# EAGLE design PiZero_breakout (EAGLE 8.6.0)
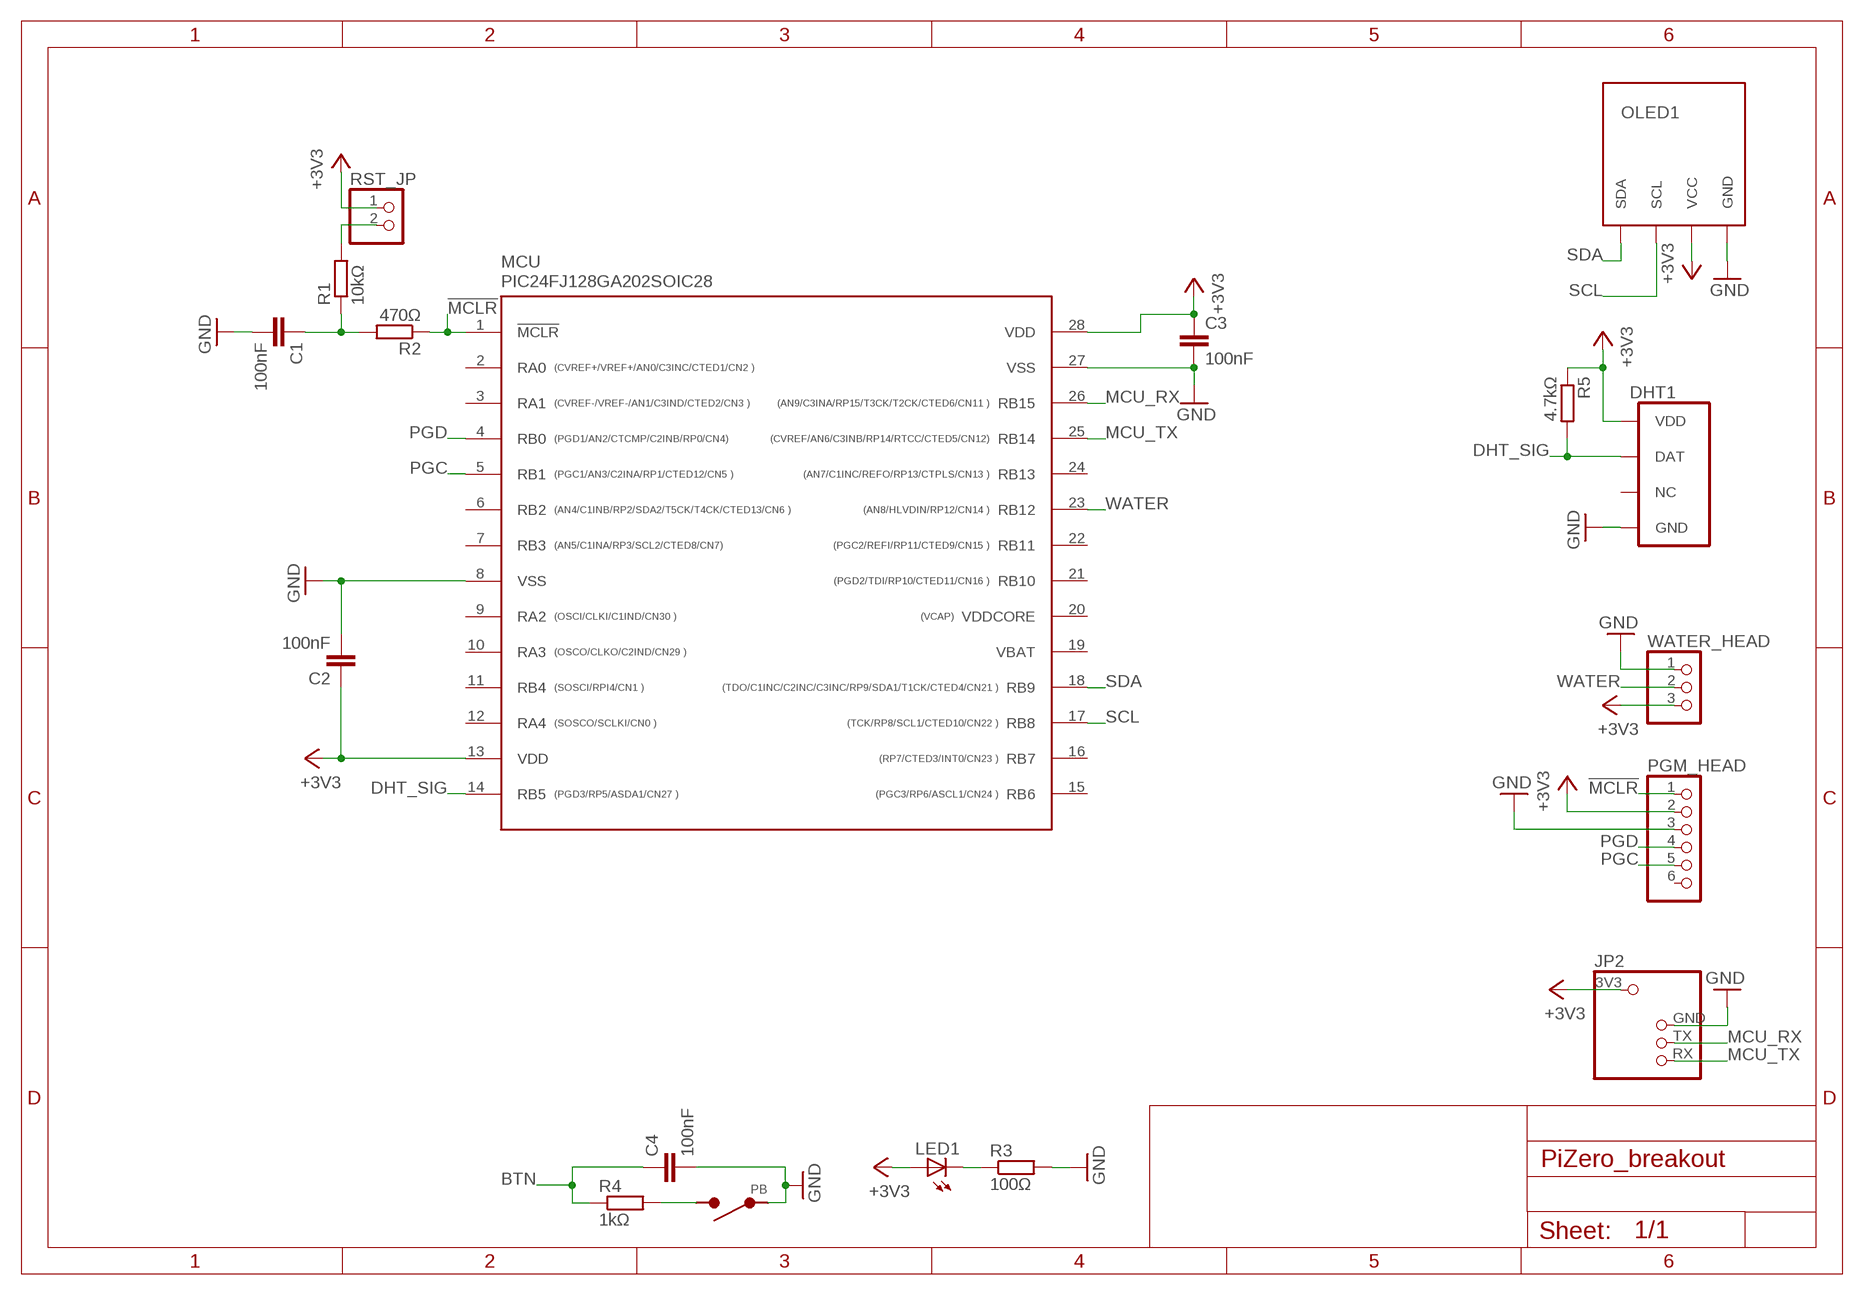
[diagram p0: schematic, sheet 1]

## Parts
C1  100nF  C-EUC0805  [C0805]
C2  100nF  C-EUC0805  [C0805]
C3  100nF  C-EUC0805  [C0805]
C4  100nF  C-EUC0805  [C0805]
DHT1  DHT11VERT  [DHT11]
JP2  RPI_UART_HEADER  [RPI_UART_HEAD]
LED1  LEDCHIPLED_0805  [CHIPLED_0805]
MCU  PIC24FJ128GA202SOIC28  [SOIC28L]
OLED1  OLED_4PIN_I2C  [OLED_4PIN]
PB  PUSHBUTTON_2LEG  [PUSHBUTTON_6X3.5MM]
PGM_HEAD  PINHD-1X6  [1X06]
R1  10kΩ  R-EU_R0805  [R0805]
R2  470Ω  R-EU_R0805  [R0805]
R3  100Ω  R-EU_R0805  [R0805]
R4  1kΩ  R-EU_R0805  [R0805]
R5  4.7kΩ  R-EU_R0805  [R0805]
RST_JP  PINHD-1X2  [1X02]
WATER_HEAD  PINHD-1X3  [1X03]

## Nets
!MCLR: MCU.1(!MCLR) PGM_HEAD.1 R2.1
+3V3: C2.1 C3.1 DHT1.VDD JP2.3V3 LED1.A MCU.13(VDD) MCU.28(VDD) OLED1.VCC PGM_HEAD.2 R5.1 RST_JP.1 WATER_HEAD.3
BTN: C4.1 R4.1
DHT_SIG: DHT1.DAT MCU.14(RB5) R5.2
GND: C1.2 C2.2 C3.2 C4.2 DHT1.GND JP2.GND MCU.8(VSS) MCU.27(VSS) OLED1.GND PB.P$1 PGM_HEAD.3 R3.2 WATER_HEAD.1
MCU_RX: JP2.TX MCU.26(RB15)
MCU_TX: JP2.RX MCU.25(RB14)
N$1: C1.1 R1.1 R2.2
N$2: LED1.C R3.1
N$3: R1.2 RST_JP.2
N$4: PB.P$2 R4.2
PGC: MCU.5(RB1) PGM_HEAD.5
PGD: MCU.4(RB0) PGM_HEAD.4
SCL: MCU.17(RB8) OLED1.SCL
SDA: MCU.18(RB9) OLED1.SDA
WATER: MCU.23(RB12) WATER_HEAD.2
Unconnected: DHT1.NC MCU.2(RA0) MCU.3(RA1) MCU.6(RB2) MCU.7(RB3) MCU.9(RA2) MCU.10(RA3) MCU.11(RB4) MCU.12(RA4) MCU.15(RB6) MCU.16(RB7) MCU.19(VBAT) MCU.21(RB10) MCU.22(RB11) MCU.24(RB13) PGM_HEAD.6

## Power pins joined to a net without a drawn wire
VDDCORE: MCU.20(VDDCORE)

## Library data of the parts
C1-C4 = rcl:C-EU: CAPACITOR, European symbol; SPICEPREFIX: C
DHT1 = EAF_library:DHT11
JP2 = EAF_library:RPI_UART_HEADER: PIN HEADER
LED1 = led:LED: LED OSRAM: - CHIPLED LG R971, LG N971, LY N971, LG Q971, LY Q971, LO R971, LY R971 LH N974, LH R974 LS Q976, LO Q976, LY Q976 LO Q996 - Hyper CHIPLED LW Q18S LB Q993, LB Q99A, LB R99A - SideLED LS A670, LO A670, LY A670, LG A670, LP A670 LB A673, LV A673, LT A673, LW A673 LH A674 LY A675 LS A676, LA A676, LO A676, LY A676, LW A676 LS A679, LY A679, LG A679 - Hyper Micro SIDELED® LS Y876, LA Y876, LO Y876, LY Y876 LT Y87S - SmartLED LW L88C, LW L88S LB L89C, LB L89S, LG L890 LS L89K, LO L89K, LY L89K LS L896, LA L896, LO L896, LY L896 - TOPLED LS T670, LO T670, LY T670, LG T670, LP T670 LSG T670, LSP T670, LSY T670, LOP T670, LYG T670 LG T671, LOG T671, LSG T671 LB T673, LV T673, LT T673, LW T673 LH T674 LS T676, LA T676, LO T676, LY T676, LB T676, LH T676, LSB T676, LW T676 LB T67C, LV T67C, LT T67C, LS T67K, LO T67K, LY T67K, LW E67C LS E67B, LA E67B, LO E67B, LY E67B, LB E67C, LV E67C, LT E67C LW T67C LS T679, LY T679, LG T679 LS T770, LO T770, LY T770, LG T770, LP T770 LB T773, LV T773, LT T773, LW T773 LH T774 LS E675, LA E675, LY E675, LS T675 LS T776, LA T776, LO T776, LY T776, LB T776 LHGB T686 LT T68C, LB T68C - Hyper Mini TOPLED® LB M676 - Mini TOPLED Santana® LG M470 LS M47K, LO M47K, LY M47K Source: http://www.osram.convergy.de LUXEON: - LUMILED® LXK2-PW12-R00, LXK2-PW12-S00, LXK2-PW14-U00, LXK2-PW14-V00 LXK2-PM12-R00, LXK2-PM12-S00, LXK2-PM14-U00 LXK2-PE12-Q00, LXK2-PE12-R00, LXK2-PE12-S00, LXK2-PE14-T00, LXK2-PE14-U00 LXK2-PB12-K00, LXK2-PB12-L00, LXK2-PB12-M00, LXK2-PB14-N00, LXK2-PB14-P00, LXK2-PB14-Q00 LXK2-PR12-L00, LXK2-PR12-M00, LXK2-PR14-Q00, LXK2-PR14-R00 LXK2-PD12-Q00, LXK2-PD12-R00, LXK2-PD12-S00 LXK2-PH12-R00, LXK2-PH12-S00 LXK2-PL12-P00, LXK2-PL12-Q00, LXK2-PL12-R00 Source: www.luxeon.com KINGBRIGHT: KA-3528ASYC Source: www.kingbright.com
MCU = EAF_library:PIC24FJ128GA202
OLED1 = EAF_library:OLED_4PIN_I2C
PB = EAF_library:PUSHBUTTON_2LEG
PGM_HEAD = pinhead:PINHD-1X6: PIN HEADER
R1-R5 = rcl:R-EU_: RESISTOR, European symbol; SPICEPREFIX: R
RST_JP = pinhead:PINHD-1X2: PIN HEADER
WATER_HEAD = pinhead:PINHD-1X3: PIN HEADER

## Board
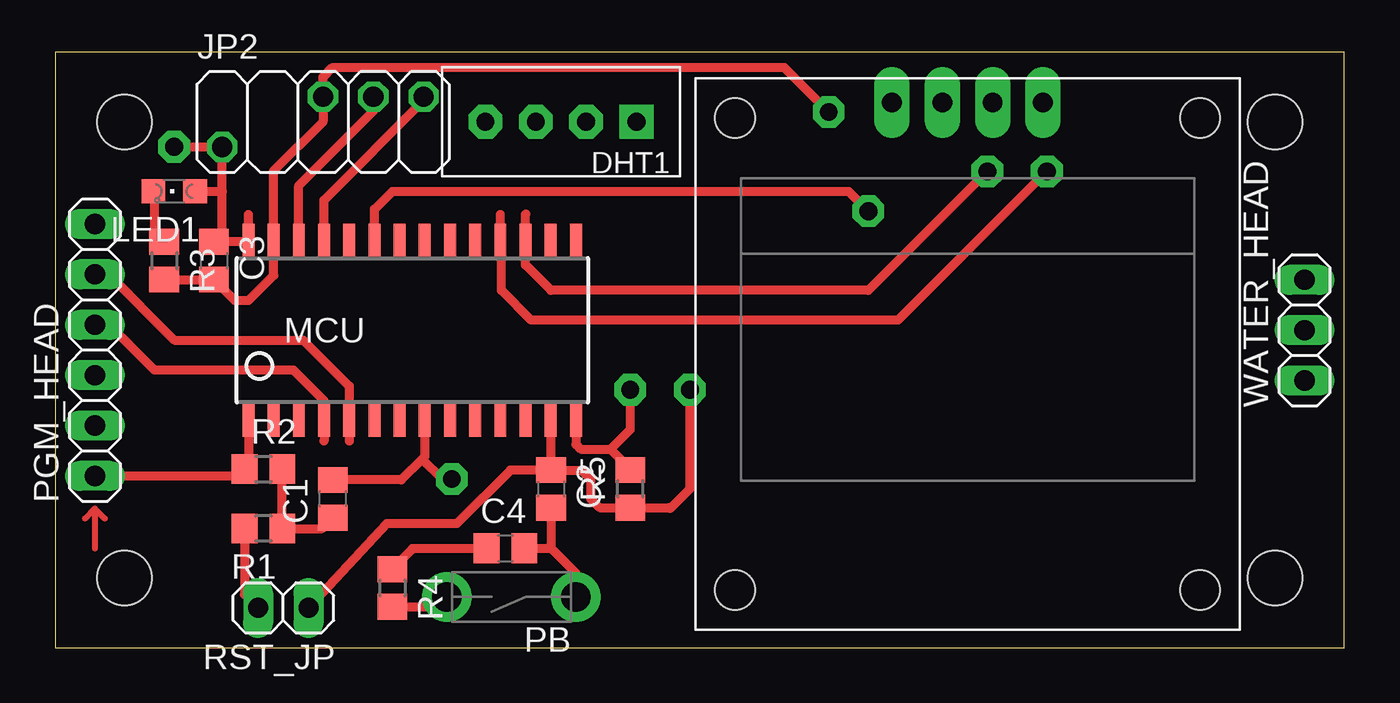
[diagram p1: board, top side]
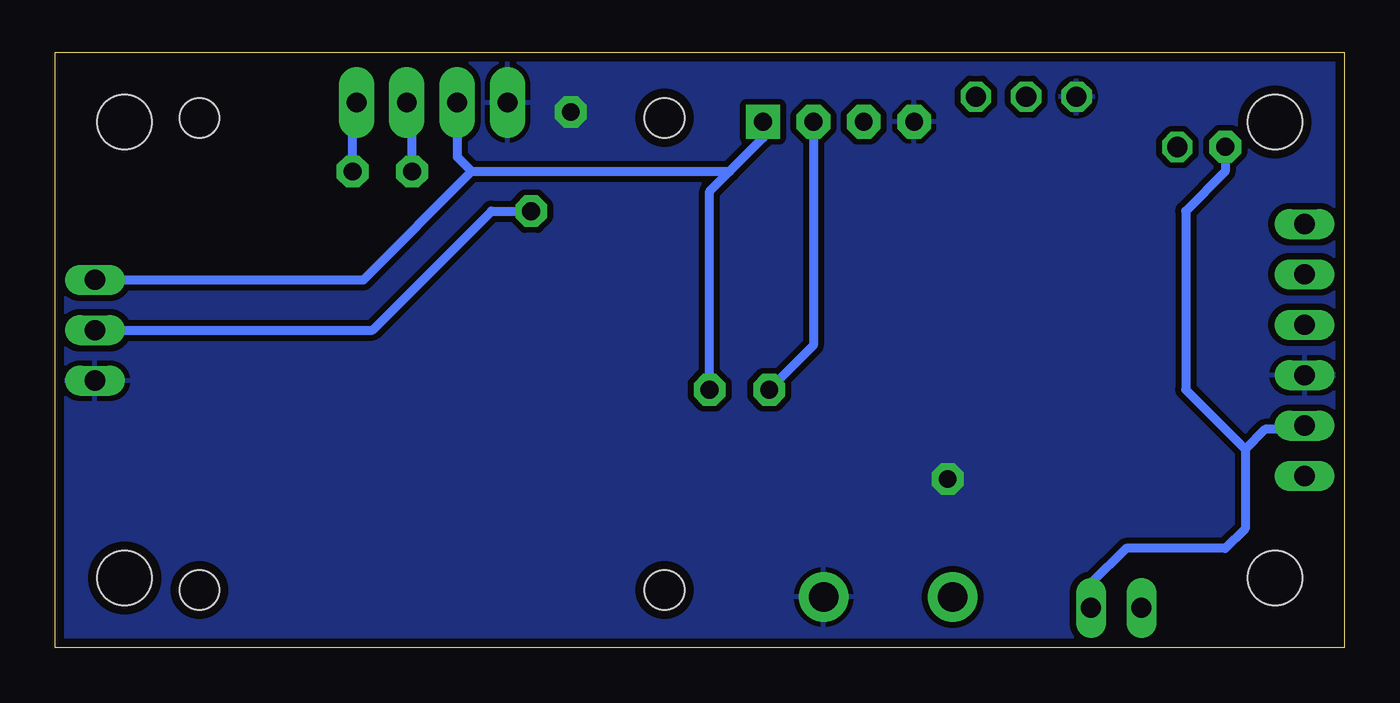
[diagram p2: board, bottom side, seen from below]

Size 65 x 30 mm. Coordinates in mm from the lower left corner, seen from the top.
Outline: 0,0 65,0 65,30 0,30 0,0
Copper layers (1*16): Top 0.035mm / dielectric 1.5mm / Bottom 0.035mm
Design rules "DesignRules *": minimum track width 6mil, minimum drill 0.35mm, track to track 12mil, track to pad 12mil, pad to pad 12mil, via to via 12mil, smd to smd 6mil, copper to edge 18mil, drill to drill 6mil, minimum pad ring 10mil, minimum via ring 8mil, stop-mask expansion 4mil, vias tented up to drill 0mil, thermal gap 10mil
Holes 2.75 mm at 3.5,26.5 61.5,26.5 61.5,3.5 3.5,3.5
bRestrict: area 12.5,26.8 to 14.5,28.8

### Footprints (pad centres in the part's own frame; a part is rotated, then mirrored left to right if it is on the bottom)
C0805 = smd 1.3 x 1.5: 1 -0.95,0; 2 0.95,0
DHT11 = drill 0.9 pad 1.7 octagon: DAT -1.27,0; GND 3.81,0; NC 1.27,0 | drill 0.9 pad 1.7 square: VDD -3.81,0
RPI_UART_HEAD = drill 1.016 octagon: 3V3 -5.08,-1.27; GND 0,1.27; RX 5.08,1.27; TX 2.54,1.27
CHIPLED_0805 = smd 1.2 x 1.2: A 0,-1.05; C 0,1.05
SOIC28L = smd 0.6 x 1.8: 1 -8.255,-4.475; 2 -6.985,-4.475; 3 -5.715,-4.475; 4 -4.445,-4.475; 5 -3.175,-4.475; 6 -1.905,-4.475; 7 -0.635,-4.475; 8 0.635,-4.475; 9 1.905,-4.475; 10 3.175,-4.475; 11 4.445,-4.475; 12 5.715,-4.475; 13 6.985,-4.475; 14 8.255,-4.475; 15 8.255,4.475; 16 6.985,4.475; 17 5.715,4.475; 18 4.445,4.475; 19 3.175,4.475; 20 1.905,4.475; 21 0.635,4.475; 22 -0.635,4.475; 23 -1.905,4.475; 24 -3.175,4.475; 25 -4.445,4.475; 26 -5.715,4.475; 27 -6.985,4.475; 28 -8.255,4.475
OLED_4PIN = drill 1 pad 1.778 long: GND 3.81,-13.976; SCL -1.27,-13.976; SDA -3.81,-13.976; VCC 1.27,-13.976 | hole 2: -11.725,10.599; -11.725,-13.201; 11.725,-13.201; 11.725,10.599
PUSHBUTTON_6X3.5MM = drill 1.5 pad 2.5: P$1 1.25,-0.25; P$2 1.25,6.25
1X06 = drill 1.016 long: 1 -6.35,0; 2 -3.81,0; 3 -1.27,0; 4 1.27,0; 5 3.81,0; 6 6.35,0
R0805 = smd 1.3 x 1.5: 1 -0.95,0; 2 0.95,0
1X02 = drill 1.016 long: 1 -1.27,0; 2 1.27,0
1X03 = drill 1.016 long: 1 -2.54,0; 2 0,0; 3 2.54,0

### Placement (x,y rotation side)
C1  14,7.5 90 top
C2  25,8 270 top
C3  8,19.5 270 top
C4  22.7,5 0 top
DHT1  25.5,26.5 180 top
JP2  13.5,26.5 0 top
LED1  6,23 90 top
MCU  18,16 0 top
OLED1  46,13.5 180 top
PB  26,1.3 90 top
PGM_HEAD  2,15 90 top
R1  10.5,6 180 top
R2  10.5,9 0 top
R3  5.5,19.5 270 top
R4  17,3 270 top
R5  29,8 90 top
RST_JP  11.5,2 180 top
WATER_HEAD  63,16 90 top

### Tracks (layer width: path | path; a pad name or v marks a point on that pad's centre or on a via)
!MCLR
  Top 0.457: MCU.1 9.74,9.2 R2.1 9.2,8.65 PGM_HEAD.1
+3V3  (via drill 0.9 pad 1.6)
  Top 0.457: 25.05,11.46 MCU.13 24.98,8.96 C2.1 | RST_JP.1 16.72,6.26 20.26,6.26 22.95,8.95 C2.1 | 8.42,23 8.42,20.87 C3.1 9.72,20.45 MCU.28 9.74,21.82 9.75,21.82 | 8.42,23 JP2.3V3 6.02,25.23 v6,25.25 | LED1.A 8.42,23 | C2.1 26.55,8.95 27,8.5 27,7.5 27.45,7.05 R5.1 30.95,7.05 31,7 32,8 v32,13
  Bottom 0.457: OLED1.VCC 44.73,24.73 44,24 | 44,24 31,24 | 31,24 29.31,25.69 DHT1.VDD | PGM_HEAD.2 2.19,11 4,11 5,10 | 5,10 5,6 6,5 11,5 12.77,3.23 RST_JP.1 | WATER_HEAD.3 49.46,18.54 44,24 | v32,13 32,23 31,24 | v6,25.25 6,24 8,22 8,13 5,10
BTN
  Top 0.457: R4.1 18,4.95 18,5 C4.1
DHT_SIG  (via drill 0.9 pad 1.6)
  Top 0.457: MCU.14 26.25,10.24 26.5,10 28,10 | 28,10 29,9 R5.2 | v29,13 29,11 28,10
  Bottom 0.457: DHT1.DAT 26.77,15.23 v29,13
GND  (via drill 0.9 pad 1.6)
  Top 0.457: C4.2 25,5 | 25,5 26.25,3.75 PB.P$1 | MCU.8 18.64,9.63 18.5,9.5 | C1.2 17.45,8.45 18.5,9.5 | R3.2 C3.2 9.05,17.5 9.75,17.5 11.02,18.77 MCU.27 11,20.49 11,24 13.5,26.5 JP2.GND 13.5,28.75 14,29.25 36.75,29.25 v39,27 | 18.5,9.5 19.5,8.5 v20,8.5 | C2.2 25,5
  pour Bottom: 0,30 0,0 65,0 65,30
MCU_RX
  Top 0.457: MCU.26 12.29,23.29 16.04,27.04 JP2.TX
MCU_TX
  Top 0.457: MCU.25 13.55,22.55 18.58,27.58 JP2.RX
N$1
  Top 0.457: R2.2 R1.1 13.45,6 C1.1
N$2
  Top 0.457: LED1.C 5,22.95 5,20.95 R3.1
N$3
  Top 0.457: R1.2 9.55,2.68 RST_JP.2
N$4
  Top 0.457: R4.2 19.25,2.05 PB.P$2
N$5
  Top 0.305: 2,7 2,5 | 2,7 1.5,6.5 | 2,7 2.5,6.5
PGC
  Top 0.457: 14.82,10.4 MCU.5 14.82,13.18 12.5,15.5 6,15.5 2.69,18.81 PGM_HEAD.5
PGD
  Top 0.457: 13.55,10.4 MCU.4 13.55,12.45 12,14 5,14 2.73,16.27 PGM_HEAD.4
SCL  (via drill 0.9 pad 1.6)
  Top 0.457: v47,24 41,18 25,18 23.71,19.29 MCU.17 23.71,21.84 23.73,21.85
  Bottom 0.457: v47,24 47,27.21 arc-90 OLED1.SCL
SDA  (via drill 0.9 pad 1.6)
  Top 0.457: v50,24 42.5,16.5 24,16.5 22.5,18 22.5,20.42 MCU.18 22.45,21.82
  Bottom 0.457: v50,24 50,27.29 arc90 OLED1.SDA
WATER  (via drill 0.9 pad 1.6)
  Top 0.457: MCU.23 16.09,22.09 17,23 40,23 v41,22
  Bottom 0.457: WATER_HEAD.2 49,16 43,22 v41,22